# EAGLE design 2164_svf_single_plane_smd (EAGLE 9.6.2)
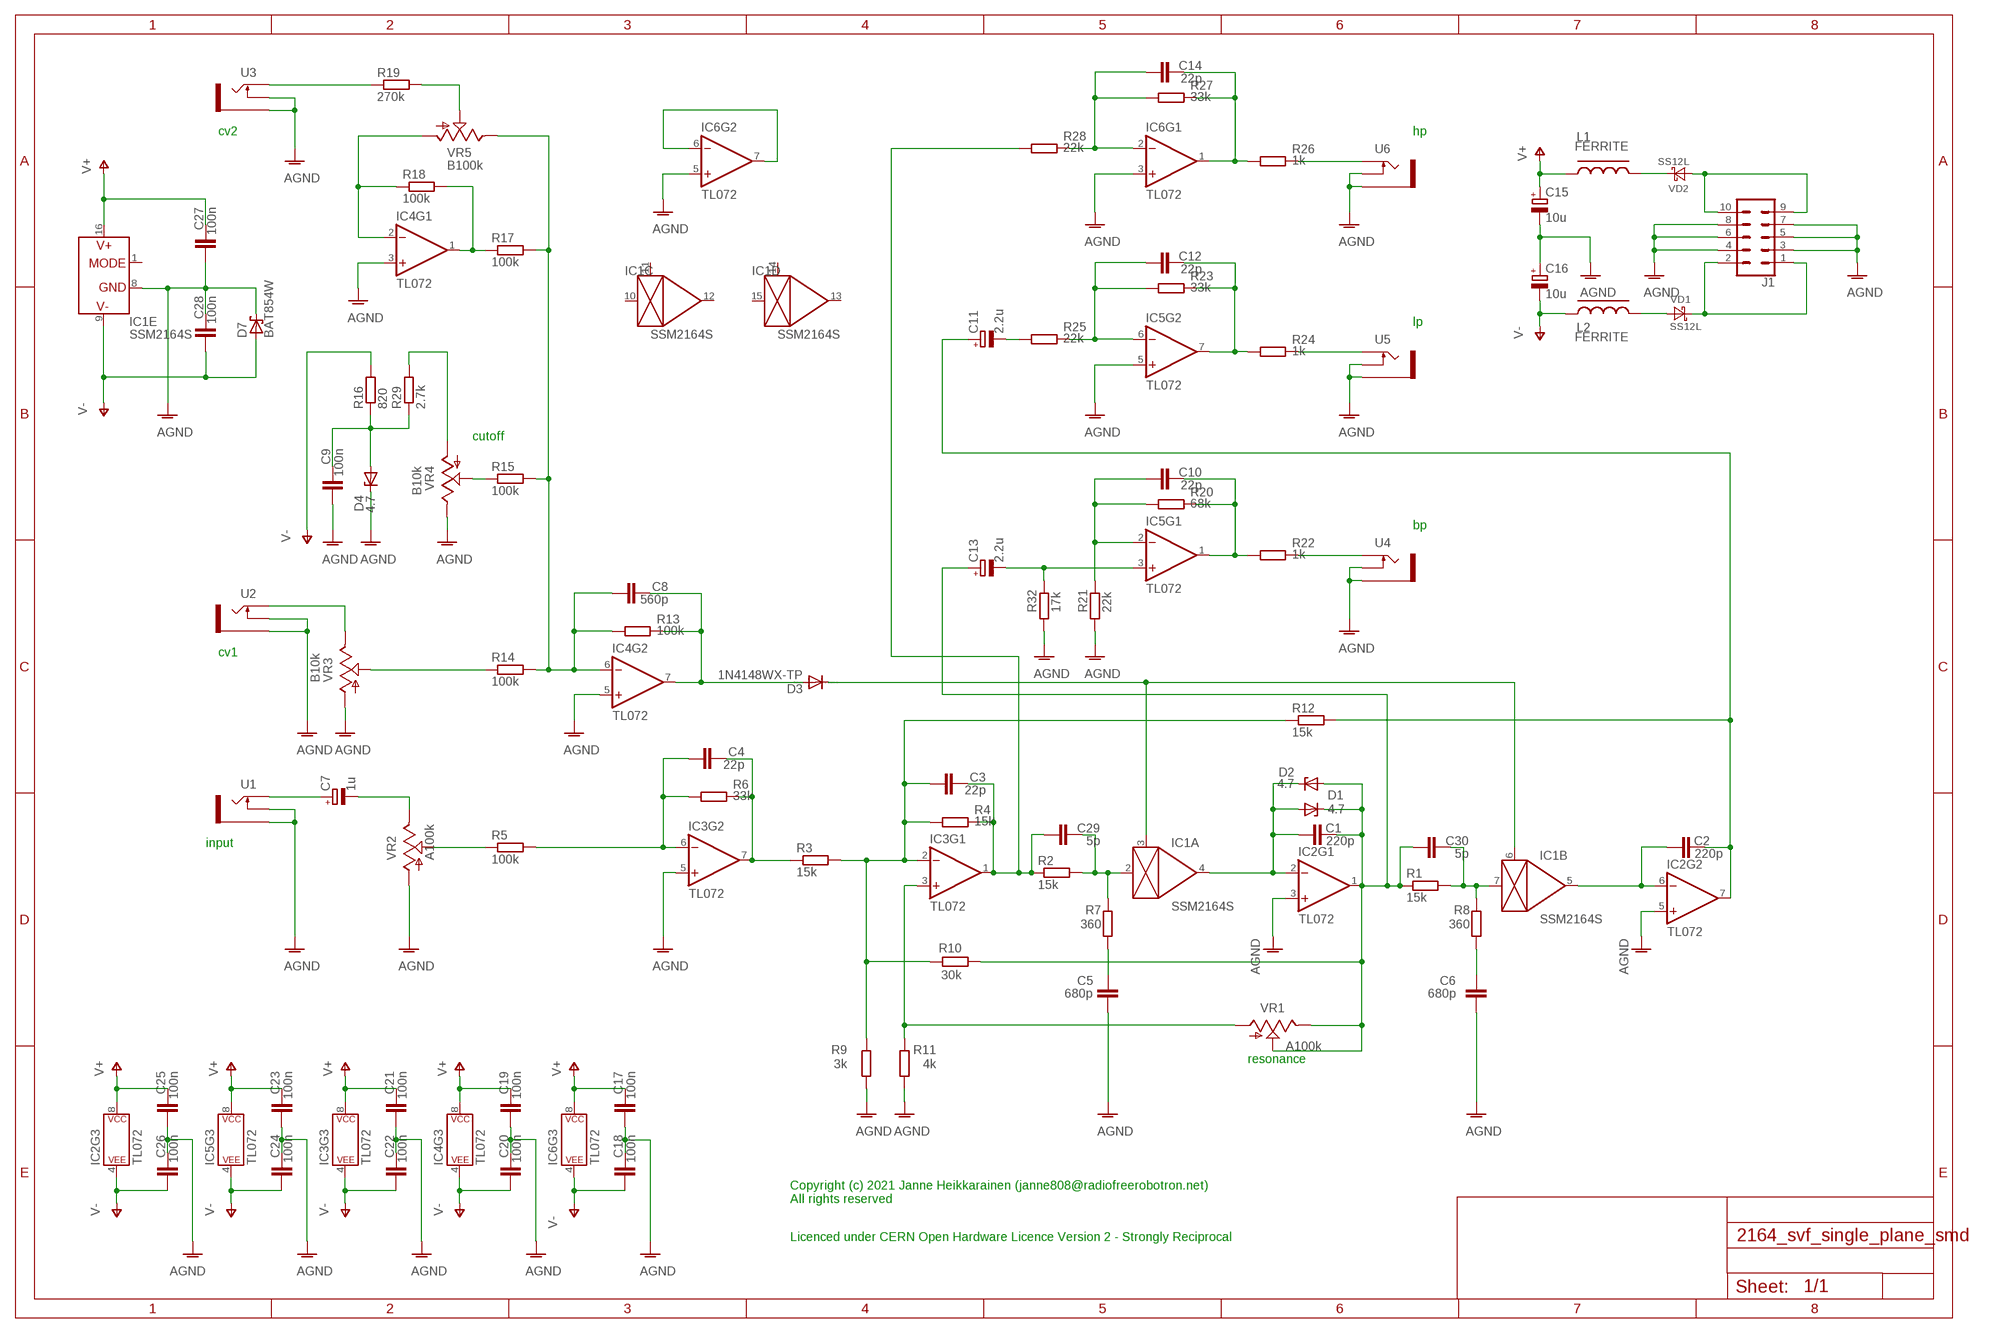
[diagram p0: schematic, sheet 1]

## Parts
C1  220p  C-EUC0603  [C0603]
C2  220p  C-EUC0603  [C0603]
C3  22p  C-EUC0603  [C0603]
C4  22p  C-EUC0603  [C0603]
C5  680p  C-EUC0603  [C0603]
C6  680p  C-EUC0603  [C0603]
C7  1u  CPOL-EUB  [PANASONIC_B]
C8  560p  C-EUC0603  [C0603]
C9  100n  C-EUC0603  [C0603]
C10  22p  C-EUC0603  [C0603]
C11  2.2u  CPOL-EUB  [PANASONIC_B]
C12  22p  C-EUC0603  [C0603]
C13  2.2u  CPOL-EUB  [PANASONIC_B]
C14  22p  C-EUC0603  [C0603]
C15  10u  CPOL-EUB  [PANASONIC_B]
C16  10u  CPOL-EUB  [PANASONIC_B]
C17  100n  C-EUC0603  [C0603]
C18  100n  C-EUC0603  [C0603]
C19  100n  C-EUC0603  [C0603]
C20  100n  C-EUC0603  [C0603]
C21  100n  C-EUC0603  [C0603]
C22  100n  C-EUC0603  [C0603]
C23  100n  C-EUC0603  [C0603]
C24  100n  C-EUC0603  [C0603]
C25  100n  C-EUC0603  [C0603]
C26  100n  C-EUC0603  [C0603]
C27  100n  C-EUC0603  [C0603]
C28  100n  C-EUC0603  [C0603]
C29  5p  C-EUC0603  [C0603]
C30  5p  C-EUC0603  [C0603]
D1  4.7  DIODE_ZENER-DIODESOD80C  [DIODE_SOD80C]
D2  4.7  DIODE_ZENER-DIODESOD80C  [DIODE_SOD80C]
D3  1N4148WX-TP  [SOD323R-INFINEON]
D4  4.7  DIODE_ZENER-DIODESOD80C  [DIODE_SOD80C]
D7  BAT854W  1PS70SB10  [SOT323]
IC1  SSM2164S  [SOIC16N]
IC2  TL072  OPAMP-DUALU  [SO08]
IC3  TL072  OPAMP-DUALU  [SO08]
IC4  TL072  OPAMP-DUALU  [SO08]
IC5  TL072  OPAMP-DUALU  [SO08]
IC6  TL072  OPAMP-DUALU  [SO08]
J1  CONN_05X2SHD  [2X5-SHROUDED]
L1  FERRITE  EXC3BP  [0603]
L2  FERRITE  EXC3BP  [0603]
R1  15k  R-EU_R0603  [R0603]
R2  15k  R-EU_R0603  [R0603]
R3  15k  R-EU_R0603  [R0603]
R4  15k  R-EU_R0603  [R0603]
R5  100k  R-EU_R0603  [R0603]
R6  33k  R-EU_R0603  [R0603]
R7  360  R-EU_R0603  [R0603]
R8  360  R-EU_R0603  [R0603]
R9  3k  R-EU_R0603  [R0603]
R10  30k  R-EU_R0603  [R0603]
R11  4k  R-EU_R0603  [R0603]
R12  15k  R-EU_R0603  [R0603]
R13  100k  R-EU_R0603  [R0603]
R14  100k  R-EU_R0603  [R0603]
R15  100k  R-EU_R0603  [R0603]
R16  820  R-EU_R0603  [R0603]
R17  100k  R-EU_R0603  [R0603]
R18  100k  R-EU_R0603  [R0603]
R19  270k  R-EU_R0603  [R0603]
R20  68k  R-EU_R0603  [R0603]
R21  22k  R-EU_R0603  [R0603]
R22  1k  R-EU_R0603  [R0603]
R23  33k  R-EU_R0603  [R0603]
R24  1k  R-EU_R0603  [R0603]
R25  22k  R-EU_R0603  [R0603]
R26  1k  R-EU_R0603  [R0603]
R27  33k  R-EU_R0603  [R0603]
R28  22k  R-EU_R0603  [R0603]
R29  2.7k  R-EU_R0603  [R0603]
R32  17k  R-EU_R0603  [R0603]
U1  THONKICONNNEW  [WQP-PJ301M-12_JACK]
U2  THONKICONNNEW  [WQP-PJ301M-12_JACK]
U3  THONKICONNNEW  [WQP-PJ301M-12_JACK]
U4  THONKICONNNEW  [WQP-PJ301M-12_JACK]
U5  THONKICONNNEW  [WQP-PJ301M-12_JACK]
U6  THONKICONNNEW  [WQP-PJ301M-12_JACK]
VD1  SS12L  DIODE-SCHOTTKY-SMA  [SMA]
VD2  SS12L  DIODE-SCHOTTKY-SMA  [SMA]
VR1  A100k  9MM_SNAP-IN_POT_  [9MM_SNAP-IN_POT]
VR2  A100k  9MM_SNAP-IN_POT_  [9MM_SNAP-IN_POT]
VR3  B10k  9MM_SNAP-IN_POT_  [9MM_SNAP-IN_POT]
VR4  B10k  9MM_SNAP-IN_POT_  [9MM_SNAP-IN_POT]
VR5  B100k  9MM_SNAP-IN_POT_  [9MM_SNAP-IN_POT]

## Nets
AGND: C5.1 C6.1 C9.1 C15.- C16.+ C17.1 C18.2 C19.1 C20.2 C21.1 C22.2 C23.1 C24.2 C25.1 C26.2 C27.1 C28.2 D4.C D7.3(K) IC1.8(E:GND) IC2.3(+IN) IC2.5(+IN) IC3.5(+IN) IC4.3(+IN) IC4.5(+IN) IC5.5(+IN) IC6.3(+IN) IC6.5(+IN) J1.3 J1.4 J1.5 J1.6 J1.7 J1.8 R9.1 R11.1 R21.1 R32.1 U1.P$2_SWITCH(SWITCH) U1.P$3_SLEEVE(SLEEVE) U2.P$2_SWITCH(SWITCH) U2.P$3_SLEEVE(SLEEVE) U3.P$2_SWITCH(SWITCH) U3.P$3_SLEEVE(SLEEVE) U4.P$2_SWITCH(SWITCH) U4.P$3_SLEEVE(SLEEVE) U5.P$2_SWITCH(SWITCH) U5.P$3_SLEEVE(SLEEVE) U6.P$2_SWITCH(SWITCH) U6.P$3_SLEEVE(SLEEVE) VR2.1(A) VR3.1(A) VR4.3(E)
N$1: C1.1 D1.A D2.C IC1.4(A:OUT) IC2.2(-IN)
N$2: C2.1 IC1.5(B:OUT) IC2.6(-IN)
N$3: R15.1 VR4.2(S)
N$4: C30.2 IC1.7(B:IN) R1.2 R8.2
N$5: C3.2 C29.1 IC3.1(OUT) R2.1 R4.2 R28.1
N$6: C29.2 IC1.2(A:IN) R2.2 R7.2
N$7: C9.2 D4.A R16.1 R29.1
N$8: C4.2 IC3.7(OUT) R3.1 R6.2
N$9: C3.1 IC3.2(-IN) R3.2 R4.1 R9.2 R10.2 R12.1
N$10: C4.1 IC3.6(-IN) R5.2 R6.1
N$11: R29.2 VR4.1(A)
N$12: C2.2 C11.+ IC2.7(OUT) R12.2
N$13: C7.- VR2.3(E)
N$14: C7.+ U1.P$1_TIP(TIP)
N$15: C5.2 R7.1
N$16: C6.2 R8.1
N$17: C8.2 D3.A IC4.7(OUT) R13.2
N$18: D3.C IC1.3(A:CTRL) IC1.6(B:CTRL)
N$19: R14.1 VR3.2(S)
N$20: R5.1 VR2.2(S)
N$21: U2.P$1_TIP(TIP) VR3.3(E)
N$22: R26.2 U6.P$1_TIP(TIP)
N$23: IC4.1(OUT) R17.1 R18.2
N$24: R24.2 U5.P$1_TIP(TIP)
N$25: R22.2 U4.P$1_TIP(TIP)
N$26: C10.1 IC5.2(-IN) R20.1 R21.2
N$27: R19.1 U3.P$1_TIP(TIP)
N$28: R19.2 VR5.2(S)
N$29: C10.2 IC5.1(OUT) R20.2 R22.1
N$30: C13.- IC5.3(+IN) R32.2
N$31: C12.1 IC5.6(-IN) R23.1 R25.2
N$32: L1.2 VD2.C
N$33: C12.2 IC5.7(OUT) R23.2 R24.1
N$34: C11.- R25.1
N$35: L2.2 VD1.A
N$37: IC6.6(-IN) IC6.7(OUT)
N$39: C14.2 IC6.1(OUT) R26.1 R27.2
N$40: C14.1 IC6.2(-IN) R27.1 R28.2
N$42: J1.1 J1.2 VD1.C
N$43: J1.9 J1.10 VD2.A
TO_CV2_POT1: C8.1 IC4.6(-IN) R13.1 R14.2 R15.2 R17.2 VR5.3(E)
TO_CV2_POT2: IC4.2(-IN) R18.1 VR5.1(A)
TO_RESO_POT1: C1.2 C13.+ C30.1 D1.C D2.A IC2.1(OUT) R1.1 R10.1 VR1.2(S) VR1.3(E)
TO_RESO_POT2: IC3.3(+IN) R11.2 VR1.1(A)
V+: C15.+ C17.2 C19.2 C21.2 C23.2 C25.2 C27.2 IC1.16(E:V+) IC2.8(P$V+) IC3.8(P$V+) IC4.8(P$V+) IC5.8(P$V+) IC6.8(P$V+) L1.1
V-: C16.- C18.1 C20.1 C22.1 C24.1 C26.1 C28.1 D7.1(A) IC1.9(E:V-) IC2.4(P$V-) IC3.4(P$V-) IC4.4(P$V-) IC5.4(P$V-) IC6.4(P$V-) L2.1 R16.2
Unconnected: IC1.1(E:MODE) IC1.10(C:IN) IC1.11(C:CTRL) IC1.12(C:OUT) IC1.13(D:OUT) IC1.14(D:CTRL) IC1.15(D:IN)

## Notes on the sheet
- cv2 | hp
- lp
- cutoff
- bp
- cv1
- input
- resonance
- Copyright (c) 2021 Janne Heikkarainen (janne808@radiofreerobotron.net)
  All rights reserved
- Licenced under CERN Open Hardware Licence Version 2 - Strongly Reciprocal

## Library data of the parts
C1-C6 C8-C10 C12 C14 C17-C30 = rcl:C-EU: CAPACITOR, European symbol; SPICEPREFIX: C
C7 C11 C13 C15 C16 = rcl:CPOL-EU: POLARIZED CAPACITOR, European symbol; SPICEPREFIX: C
D1 D2 D4 = Diode-SMD:DIODE_ZENER-DIODE: Z-Diode
D3 = Diode-SMD:1N4148WX-TP
D7 = nxp_60:1PS70SB10: Schottky barrier diode Planar Schottky barrier diode encapsulated in a SOT323 very small plastic SMD package. Single diodes and double diodes with different pinning are available. AAL Eindhoven MK
IC1 = ssm2164:SSM2164
IC2-IC6 = SparkFun-IC-Amplifiers:OPAMP-DUAL: Generic op-amp footprint This component is for the standard 358 pinning of a dual op-amp From the LM358 datasheet: Pin 1: Output A Pin 2: Inverting Input A Pin 3: Non-Inverting Input A Pin 4: Gnd Pin 5: Non-Inverting Input B Pin 6: Inverting Input B Pin 7: Output B Pin 8: V+; PROD_ID: NA-XXXXX; VALUE: OP-AMP
J1 = SparkFun-Connectors:CONN_05X2: Multi connection point. Often used as Generic Header-pin footprint for 0.1 inch spaced/style header connections For AVR SPI programming port, see special device with nice symbol: "AVR_SPI_PROG_5x2.dev" You can populate with any combo of single row headers, but if you'd like an exact match, check these: 2x5 AVR ICSP Male Header <https://www.sparkfun.com/products/778> (PRT-00778) 2x5 Pin Shrouded Header <https://www.sparkfun.com/products/8506> (PRT-08506) On any of the 0.1 inch spaced packages, you can populate with these: Break Away Headers - Straight <https://www.sparkfun.com/products/116> (PRT-00116) Break Away Male Headers - Right Angle <https://www.sparkfun.com/products/553> (PRT-00553) Female Headers <https://www.sparkfun.com/products/115> (PRT-00115) Break Away Headers - Machine Pin <https://www.sparkfun.com/products/117> (PRT-00117) Break Away Female Headers - Swiss Machine Pin <https://www.sparkfun.com/products/743> (PRT-00743) Special note: the shrouded connector mates well with our 5x2 ribbon cables: 2x5 Pin IDC Ribbon Cable <https://www.sparkfun.com/products/8535> (PRT-08535); PROD_ID: CONN-08671; SF_ID: PRT-08506
L1 L2 = barthess:EXC3BP: Chip Bead Core; PARTNO: ?
R1-R29 R32 = rcl:R-EU_: RESISTOR, European symbol; SPICEPREFIX: R
U1-U6 = MusicThingModular:THONKICONN: 3.5mm socket for Eurorack modular synths
VD1 VD2 = diode:DIODE-SCHOTTKY-: SCHOTTKY DIODE
VR1-VR5 = MusicThingModular:9MM_SNAP-IN_POT: 9mm vertical snap-in pot, Alpha / Panasonic style

## Board
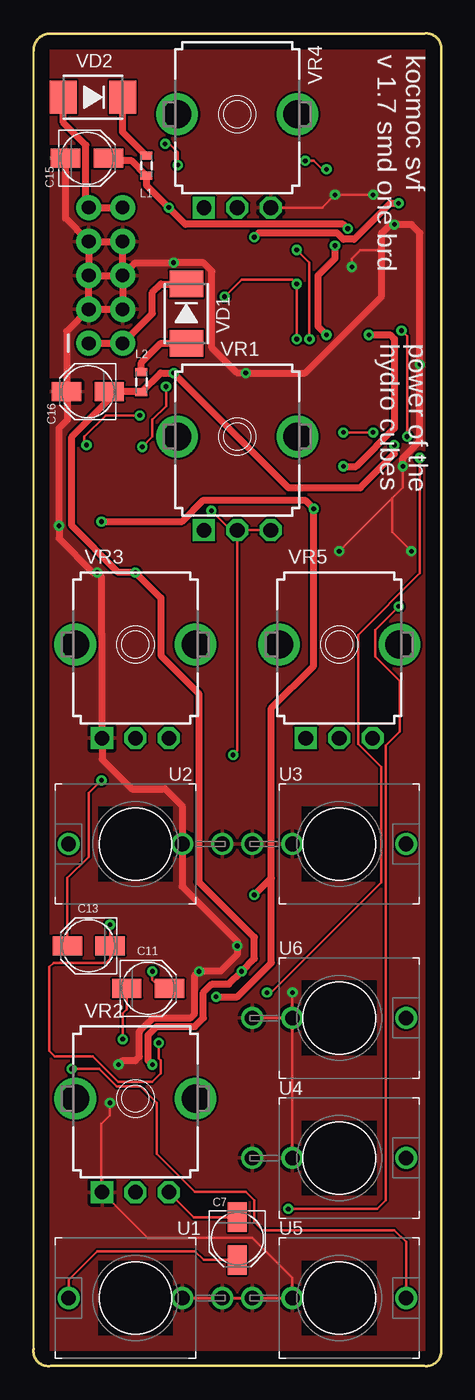
[diagram p1: board, top side]
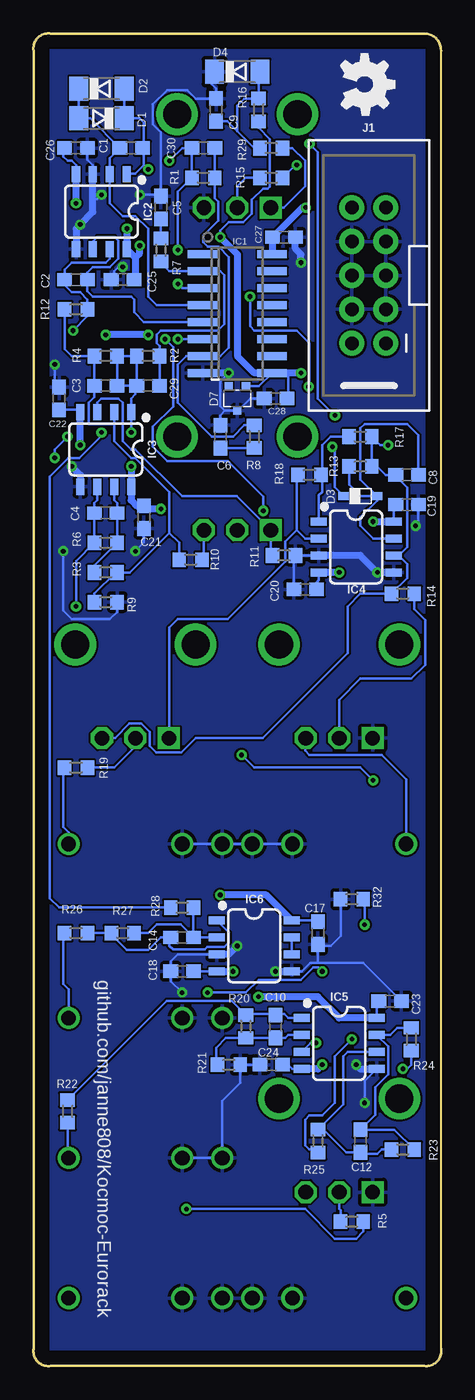
[diagram p2: board, bottom side, seen from below]

Size 30.5 x 99.72 mm. Coordinates in mm from the lower left corner, seen from the top.
Outline: 0.01,1.28 0.01,98.44 arc-90 1.28,99.71 29.22,99.71 arc-106 30.49,98.44 30.49,1.28 arc-106 29.22,0.01 1.28,0.01 arc-106 0.01,1.28
Copper layers (1*16): Top 0.035mm / dielectric 1.5mm / Bottom 0.035mm
Design rules "default": minimum track width 6mil, minimum drill 0.35mm, track to track 6mil, track to pad 6mil, pad to pad 6mil, via to via 6mil, smd to smd 6mil, copper to edge 40mil, drill to drill 6mil, minimum pad ring 10mil, minimum via ring 8mil, stop-mask expansion 4mil, vias tented up to drill 0mil, thermal gap 10mil

### Footprints (pad centres in the part's own frame; a part is rotated, then mirrored left to right if it is on the bottom)
C0603 = smd 1.1 x 1: 1 -0.85,0; 2 0.85,0
PANASONIC_B = smd 2.2 x 1.4: + 1.6,0; - -1.6,0
DIODE_SOD80C = smd 1.4 x 1.8: A 1.7,0; C -1.7,0
SOD323R-INFINEON = smd 0.8 x 0.6: A 1.25,0; C -1.25,0
SOT323 = smd 0.6 x 0.6: 1 -0.65,-0.925; 2 0.65,-0.925; 3 0,0.925
SOIC16N = smd 0.6 x 2.2: 1 -4.445,-2.6; 2 -3.175,-2.6; 3 -1.905,-2.6; 4 -0.635,-2.6; 5 0.635,-2.6; 6 1.905,-2.6; 7 3.175,-2.6; 8 4.445,-2.6; 9 4.445,2.6; 10 3.175,2.6; 11 1.905,2.6; 12 0.635,2.6; 13 -0.635,2.6; 14 -1.905,2.6; 15 -3.175,2.6; 16 -4.445,2.6
SO08 = smd 0.6 x 1.2: 1 -1.905,-2.8; 2 -0.635,-2.8; 3 0.635,-2.8; 4 1.905,-2.8; 5 1.905,2.8; 6 0.635,2.8; 7 -0.635,2.8; 8 -1.905,2.8
2X5-SHROUDED = drill 1.016 pad 1.88: 1 -1.27,5.08; 2 1.27,5.08; 3 -1.27,2.54; 4 1.27,2.54; 5 -1.27,0; 6 1.27,0; 7 -1.27,-2.54; 8 1.27,-2.54; 9 -1.27,-5.08; 10 1.27,-5.08
0603 = smd 0.6 x 0.9: 1 -0.8,0; 2 0.7,0
R0603 = smd 1 x 1.1: 1 -0.85,0; 2 0.85,0
WQP-PJ301M-12_JACK = drill 1.1: P$1_TIP 0,5; P$2_SWITCH 0,-3.5; P$3_SLEEVE 0,-6.5
SMA = smd 2 x 2.5: A 2.223,0; C -2.223,0
9MM_SNAP-IN_POT = drill 1.1 square: 1 -2.5,-7 | drill 1.1 octagon: 2 0,-7; 3 2.5,-7 | drill 2.1 pad 2.794: CHASSIS1 -4.5,0; CHASSIS2 4.5,0

### Placement (x,y rotation side)
C1  23.19,91.13 0 bottom
C2  27.32,81.29 180 bottom
C3  25.09,73.35 0 bottom
C4  25.09,63.83 0 bottom
C5  20.97,86.69 270 bottom
C6  16.52,69.54 270 bottom
C7  15.25,9.54 270 top
C8  2.55,66.69 0 bottom
C9  16.84,93.99 270 bottom
C10  12.39,25.41 90 bottom
C11  8.58,28.27 0 top
C12  6.04,16.84 90 bottom
C13  4.14,31.44 180 top
C14  19.38,32.08 180 bottom
C15  4.01,90.37 0 top
C16  4.07,72.91 180 top
C17  9.22,32.4 90 bottom
C18  19.38,29.54 180 bottom
C19  2.55,64.46 180 bottom
C20  10.17,58.11 180 bottom
C21  22.24,63.51 90 bottom
C22  28.59,72.4 90 bottom
C23  3.82,27.32 180 bottom
C24  12.71,22.55 180 bottom
C25  23.82,81.29 0 bottom
C26  27.32,91.13 0 bottom
C27  11.76,84.47 180 bottom
C28  12.39,72.4 180 bottom
C29  21.92,73.35 0 bottom
C30  17.79,91.13 0 bottom
D1  25.41,93.36 180 bottom
D2  25.41,95.58 0 bottom
D3  6.04,65.1 0 bottom
D4  15.25,96.85 0 bottom
D7  15.25,72.4 180 bottom
IC1  15.25,78.75 270 bottom
IC2  25.41,86.37 180 bottom
IC3  25.09,68.59 180 bottom
IC4  6.36,61.29 270 bottom
IC5  7.63,24.14 270 bottom
IC6  13.98,31.44 270 bottom
J1  5.41,81.61 180 bottom
L1  8.46,89.86 90 top
L2  8.07,73.67 90 top
R1  17.79,88.91 0 bottom
R2  21.92,75.58 0 bottom
R3  25.09,59.38 0 bottom
R4  25.09,75.58 0 bottom
R5  6.68,10.81 0 bottom
R6  25.09,61.61 0 bottom
R7  20.97,83.51 270 bottom
R8  13.98,69.54 90 bottom
R9  25.09,57.16 180 bottom
R10  18.74,60.34 180 bottom
R11  11.76,60.65 180 bottom
R12  27.32,79.07 0 bottom
R13  6.04,67.32 180 bottom
R14  2.87,57.8 180 bottom
R15  12.71,88.91 0 bottom
R16  13.66,93.99 270 bottom
R17  6.04,69.54 0 bottom
R18  9.85,66.69 0 bottom
R19  27.32,44.78 0 bottom
R20  14.62,25.41 90 bottom
R21  15.89,22.55 180 bottom
R22  27.95,19.06 270 bottom
R23  2.87,16.2 0 bottom
R24  2.23,24.46 270 bottom
R25  9.22,16.84 90 bottom
R26  27.32,32.4 180 bottom
R27  23.82,32.4 180 bottom
R28  19.38,34.3 0 bottom
R29  12.71,91.13 0 bottom
R32  6.68,34.94 0 bottom
U1  7.63,5.09 90 top
U2  7.63,39.06 90 top
U3  22.87,39.06 270 top
U4  22.87,15.57 270 top
U5  22.87,5.09 270 top
U6  22.87,26.05 270 top
U$1  [OSHW_5MM]  5.73,95.9 270 bottom
VD1  11.44,78.75 270 top
VD2  4.46,94.94 180 top
VR1  15.25,69.54 0 top
VR2  7.63,20.01 0 top
VR3  7.63,53.99 0 top
VR4  15.25,93.67 0 top
VR5  22.87,53.99 0 top

### Tracks (layer width: path | path; a pad name or v marks a point on that pad's centre or on a via)
AGND  (via drill 0.35)
  Top 0.2: v5.73,19.7 5.73,18.74 5.09,18.11 5.09,13.05 VR2.1 8.54,9.61 16.37,9.61 19.38,6.6 U5.P$2_SWITCH U5.P$3_SLEEVE U1.P$3_SLEEVE U1.P$2_SWITCH | U6.P$3_SLEEVE U6.P$2_SWITCH | U4.P$2_SWITCH U6.P$2_SWITCH | U6.P$2_SWITCH v19.37,27.94 v19.38,27.95 | v22.87,60.97 26.84,64.94 | 26.84,64.94 27.63,65.73 v27.63,67.32 | 26.84,64.94 26.84,62.4 v28.27,60.97 | v25.41,87.64 v22.55,87.64 21.6,86.69 17.77,86.69 VR4.3 | v23.82,82.24 23.82,82.88 24.46,83.51 26.05,83.51
  Top 0.508: J1.7 J1.8 J1.6 | J1.5 J1.6 | J1.3 J1.4 J1.6 | J1.3 J1.5 | J1.7 J1.5 | J1.3 2.47,77.4 C16.+ 2.42,72.85 2.55,72.72 2.55,70.81 1.92,70.18 v1.92,62.88 1.92,61.92 4.46,59.38 v4.77,59.38 5.09,59.07 5.09,54.8 5.09,47.02 VR3.1 5.13,45.4 7.34,43.19 9.85,43.19 11.13,41.91 U2.P$2_SWITCH 11.13,35.88 15.25,31.76 v15.25,31.44 15.25,30.81 13.98,29.54 v12.39,29.54 12.08,29.22 12.08,29.2 12.05,29.18 12.05,26.36 11.76,26.07 8.94,26.07 7.92,25.05 7.92,23.16 7.63,22.87 6.68,22.87 v6.36,22.55 | v27.63,67.32 27.63,67.96 28.9,69.23 v28.9,74.94 28.9,84.78 28.27,85.42 v27,85.42 26.68,85.42 26.05,84.78 26.05,83.51 26.05,80.02 20.33,74.31 v15.89,74.31 15.25,74.31 13.35,76.21 13.35,81.93 12.71,82.56 v10.49,82.56 7.63,82.56 J1.6 | J1.7 2.41,85.88 C15.-
  Bottom 0.2: C24.2 R21.1 15.04,21.18 16.37,19.85 U4.P$3_SLEEVE U4.P$2_SWITCH | IC6.5 10.43,29.54 9.8,30.17 9.22,30.17 | C23.1 5.82,30.17 9.22,30.17 | IC5.5 5.73,21.34 v5.73,19.7 | v19.38,27.95 20.23,28.8 C18.2 20.23,30.28 19.7,30.81 IC6.3 | C17.1 9.22,31.44 | 9.22,31.44 9.22,30.17 | v22.87,60.97 22.24,61.61 C21.1 | v28.27,60.97 28.27,56.53 27.63,55.89 24.78,55.89 24.24,56.42 R9.1 | C22.2 28.9,73.57 v28.9,74.94 | IC4.3 R11.1 11.02,60.54 C20.2 | IC2.3 26.05,89.86 26.47,90.28 C26.2 | D4.C 17.16,96.64 17.16,95.9 16.84,95.58 C9.1 18.36,94.84 19,95.48 20.5,95.48 21.56,94.42 21.56,92.92 20.97,92.33 20.97,87.64 | 16.18,71.48 D7.3 15.22,71.48 14.3,72.4 C28.2 | 16.18,71.48 16.52,71.13 C6.1 | v15.89,74.31 16.52,73.67 16.52,71.82 16.18,71.48 | U2.P$2_SWITCH U2.P$3_SLEEVE U3.P$3_SLEEVE U3.P$2_SWITCH | 20.97,87.64 C5.1 | 26.05,87.32 25.73,87.32 v25.41,87.64 | v22.55,87.64 20.97,87.64 | R32.1 7.53,32.18 8.27,31.44 9.22,31.44 | C19.1 1.7,63.09 v1.92,62.88 | C25.1 24.46,81.51 24.46,81.93 24.14,82.24 v23.82,82.24
  Bottom 0.508: v15.89,74.31 IC1.8 | v10.49,82.56 10.49,83.2 10.91,83.62 C27.1 | IC2.5 27.32,85.1 v27,85.42 26.05,86.37 26.05,87.32 IC2.3 | v27.63,67.32 27,66.69 IC3.5 | IC4.5 v4.77,59.38 6.04,60.65 IC4.3 | v15.25,31.44 15.89,30.81 IC6.3 | v12.39,29.54 IC6.5 | v6.36,22.55 6.04,22.24 IC5.5
  pour Top: 1.28,0.65 29.22,0.65 29.22,99.07 1.28,99.07
  pour Bottom: 1.28,0.65 29.22,0.65 29.22,99.07 1.28,99.07
N$1
  Bottom 0.2: D2.C D1.A 26.26,93.36 C1.1 24.78,90.4 IC2.2 24.78,87.01 23.82,86.05 22.87,86.05 21.92,85.1 21.92,80.02 21.28,79.39 IC1.4
N$2
  Bottom 0.2: IC1.5 22.24,78.12 22.97,78.85 22.97,79.81 23.19,80.02 26.05,80.02 26.47,80.44 C2.1 26.47,81.82 26.08,82.21 24.81,82.21 24.14,82.88 24.14,84.19 24.41,84.47 25.73,84.47 26.05,84.15 IC2.6
N$3
  Bottom 0.2: R15.1 14.62,88.91 15.25,88.28 VR4.2
N$4
  Bottom 0.2: C30.2 R1.2 16.94,87.39 16.67,87.12 16.67,85.71 17.79,84.6 17.79,84.08 17.46,83.75 16.65,83.75 15.89,82.99 15.89,76.21 16.52,75.58 IC1.7 19.06,75.58 19.7,74.94 19.7,72.08 17.16,69.54 15.57,69.54 14.72,70.39 R8.2
N$5  (via drill 0.35)
  Top 0.2: v23.19,69.86 v25.41,69.86
  Bottom 0.2: C29.1 22.87,73.25 22.87,72.72 23.19,72.4 IC3.1 v23.19,69.86 | C29.1 C3.2 R4.2 R2.1 C29.1 | v25.41,69.86 25.41,69.6 27.06,67.95 27.89,67.95 29.27,66.57 29.27,34.99 28.59,34.3 R28.1
N$6
  Bottom 0.2: C29.2 R2.2 21.07,76.31 21.28,76.53 21.28,77.16 20.97,77.48 16.73,77.48 16.24,77.97 16.24,81.64 16.52,81.93 IC1.2 20.33,81.93 20.97,82.56 R7.2
N$7
  Bottom 0.2: R29.1 13.98,91.13 15.25,92.4 | C9.2 15.99,93.14 15.25,92.4 | D4.A 13.66,96.74 R16.1 14.72,94.84 15.25,94.31 15.25,92.4
N$8
  Bottom 0.2: R3.1 25.94,59.91 R6.2 C4.2 24.24,64.57 24.46,64.78 IC3.7
N$9
  Bottom 0.2: R9.2 25.94,57.8 24.36,59.38 R3.2 23.29,59.38 20.33,62.34 | 20.33,62.34 20.33,65.42 22.87,67.96 23.19,67.96 24.46,69.23 24.46,70.5 | IC3.2 24.46,70.5 | 24.46,70.5 26.36,70.5 26.36,72.08 25.94,72.5 C3.1 R4.1 27.63,75.58 28.17,76.11 R12.1 | R10.2 19.59,61.61 20.33,62.34
N$10  (via drill 0.35)
  Top 0.2: v27.32,56.84 25.56,55.09 25.56,53.08 27.4,51.24 27.4,47.49 26.36,46.45 26.36,12.39 25.73,11.76 v19.06,11.76
  Bottom 0.2: IC3.6 25.73,64.78 25.94,64.57 C4.1 R6.1 27.32,60.23 v27.32,56.84 | v19.06,11.76 10.17,11.76 7.95,9.54 6.36,9.54 5.83,10.07 R5.2
N$11
  Bottom 0.2: VR4.1 11.77,86.67 10.17,88.28 10.17,90.18 11.12,91.13 R29.2
N$12  (via drill 0.35)
  Top 0.2: v27.53,77.48 27.95,77.06 v27.95,69.54 | v28.9,67.96 28.9,59.32 24.29,54.71 24.29,46.54 26.01,44.82 26.01,36.17 17.79,27.95 v17.47,27.95 | v8.9,29.54 8.9,28.9 9.54,28.27 C11.+
  Bottom 0.2: IC2.7 24.78,82.88 25.09,82.56 27.63,82.56 28.17,82.03 C2.2 28.17,80.87 27.63,80.34 27,80.34 26.47,79.81 R12.2 26.47,78.55 v27.53,77.48 | v27.95,69.54 28.9,68.59 v28.9,67.96 | v17.47,27.95 14.62,27.95 13.66,28.9 10.49,28.9 9.57,29.82 9.18,29.82 v8.9,29.54
N$13
  Top 0.2: VR2.3 12.01,11.14 C7.-
N$14
  Top 0.2: U1.P$1_TIP 2.63,6.44 4.77,8.58 12.08,8.58 12.72,7.94 C7.+
N$15
  Bottom 0.2: C5.2 R7.1
N$16
  Bottom 0.2: R8.1 C6.2
N$17
  Bottom 0.2: D3.A 6.04,65.1 6.89,65.95 R13.2 | IC4.7 5.09,61.92 6.04,62.88 6.04,63.51 4.79,64.76 D3.A | D3.A 6.04,66.35 6.04,70.18 5.73,70.5 2.55,70.5 1.7,69.65 C8.2
N$18  (via drill 0.35)
  Top 0.2: v8.14,68.78 8.9,69.54 8.9,70.81 9.92,71.83 v9.92,73.29 | v14.3,80.02 15.57,81.29 19.38,81.29 v19.7,80.97 v19.7,76.85
  Bottom 0.2: D3.C 7.95,65.75 7.95,68.59 v8.14,68.78 | v9.92,73.29 9.86,73.35 9.86,76.53 10.81,77.48 13.98,77.48 14.3,77.8 v14.3,80.02 | v19.7,80.97 19.38,80.66 IC1.3 | IC1.6 v19.7,76.85
N$19
  Bottom 0.2: VR3.2 7.63,49.86 6.04,51.45 2.23,51.45 1.2,52.48 1.2,55.81 2.02,56.63 R14.1
N$20
  Bottom 0.2: R5.1 7.53,11.66 7.63,11.76 VR2.2
N$21
  Bottom 0.2: U2.P$1_TIP 2.63,43.91 4.46,45.73 9.85,45.73 10.17,46.05 10.17,46.95 VR3.3
N$22
  Bottom 0.2: U6.P$1_TIP 27.87,28.19 28.27,28.59 28.27,32.29 R26.2
N$23
  Bottom 0.2: IC4.1 9.16,65.16 8.9,65.42 8.9,66.58 R18.2 8.9,66.79 8.9,68.91 8.27,69.54 R17.1
N$24  (via drill 0.35)
  Top 0.2: v2.87,22.24 4.91,22.24 6.21,20.93 7.98,20.93 9.22,19.7 9.22,15.89 12.08,13.03 15.89,13.03 16.52,12.39 16.52,10.81 17.16,10.17 27,10.17 27.87,9.3 U5.P$1_TIP
  Bottom 0.2: v2.87,22.24 2.55,22.24 2.23,22.55 R24.2
N$25
  Bottom 0.2: U4.P$1_TIP 27.95,15.65 R22.2
N$26
  Bottom 0.2: R21.2 16.84,22.66 16.84,23.82 16.1,24.56 R20.1 C10.1 11.66,24.56 11.44,24.78 IC5.2
N$27
  Bottom 0.2: U3.P$1_TIP 27.87,39.94 28.27,40.33 28.27,44.68 R19.1
N$28
  Bottom 0.2: R19.2 24.46,44.78 22.87,46.37 VR5.2
N$29
  Bottom 0.2: IC5.1 11.44,26.05 11.76,26.36 12.29,26.36 C10.2 12.5,26.36 14.51,26.36 R20.2 15.67,27.32 20.55,27.32 R22.1
N$30  (via drill 0.35)
  Top 0.2: v5.73,33.03 5.74,33.02 C13.- 5.74,30.5 5.41,30.17 1.52,30.17 1.2,29.86 1.2,23.58 1.6,23.19 4.46,23.19 6.36,21.28 8.9,21.28 9.54,21.92 9.54,22.87 9.37,23.04 v9.37,24.19
  Bottom 0.2: v5.73,33.03 5.73,34.83 R32.2 | IC5.3 9.8,24.14 9.42,24.14 v9.37,24.19
N$31
  Bottom 0.2: R23.1 4.46,16.2 4.77,15.89 5.94,15.89 C12.1 7.1,15.99 8.8,17.69 R25.2 7.31,19.59 7.31,23.19 7,23.51 IC5.6
N$32
  Top 0.508: L1.2 6.68,92.34 VD2.C
N$33
  Bottom 0.2: R24.1 3.29,25.31 3.82,24.78 IC5.7 4.83,24.76 3.98,23.91 3.98,21.83 4.94,20.87 4.94,18.79 C12.2 3.5,17.69 R23.2
N$34  (via drill 0.35)
  Top 0.2: C11.- 6.98,26.69 6.68,26.39 v6.68,24.46
  Bottom 0.2: R25.1 9.22,16.2 9.85,16.2 10.17,16.52 10.17,18.43 9.85,18.74 8.9,18.74 7.95,19.7 7.95,23.19 v6.68,24.46
N$35
  Top 0.508: L2.2 8.08,75.07 9.54,76.53 VD1.A
N$37
  Bottom 0.2: IC6.7 IC6.6
N$39
  Bottom 0.2: R26.1 R27.2 24.67,32.29 23.51,31.13 21.92,31.13 20.97,32.08 C14.2 20.33,31.98 20.33,31.44 20.05,31.16 17.69,31.16 17.49,31.36 16.24,31.36 15.89,31.72 15.89,32.45 IC6.1
N$40
  Bottom 0.2: IC6.2 C14.1 | C14.1 R28.2 | C14.1 19.48,33.03 21.28,33.03 21.92,32.4 R27.1
N$42
  Top 0.508: J1.1 J1.2 8.9,78.75 8.9,80.34 9.54,80.97 VD1.C
N$43
  Top 0.508: J1.10 J1.9 3.92,86.91 3.92,91.35 2.23,93.04 VD2.A
TO_CV2_POT1  (via drill 0.35)
  Top 0.2: v10.81,89.86 10.81,90.82 10.17,91.45 v9.85,91.45 | v7.95,71.13 5.41,71.13 3.82,69.54 3.82,69.06 v3.97,68.91
  Bottom 0.2: C8.1 3.5,66.69 | 3.5,66.69 4.14,66.69 4.77,67.32 R13.1 R17.2 4.56,68.91 v3.97,68.91 | IC4.6 3.19,60.65 | 3.19,60.65 2.55,61.29 2.55,65.73 3.5,66.69 | R15.2 10.91,89.86 v10.81,89.86 | v9.85,91.45 9.22,90.82 9.22,72.4 v7.95,71.13 | 3.19,60.65 2.55,60.02 2.55,58.96 R14.2 6.04,57.8 7,56.84 7,53.35 13.36,46.99 18.36,46.99 19.44,45.91 21.3,45.91 21.79,46.4 21.79,47.43 22.42,48.06 23.32,48.06 24.39,46.99 VR5.3
TO_CV2_POT2
  Bottom 0.2: IC4.2 10.17,61.92 10.81,62.56 | 10.81,62.56 10.81,66.58 R18.1 | 10.81,62.56 11.67,61.69 11.67,60.18 15.96,55.89 19.7,55.89 20.33,55.26 20.33,47.03 VR5.1
TO_RESO_POT1  (via drill 0.35)
  Top 0.2: VR1.2 VR1.3 | C13.+ 2.54,36.51 4.14,38.11 4.14,42.87 v5.09,43.83 | v14.93,45.73 15.25,46.05 VR1.2 | v20.33,90.18 20.97,90.18 21.6,89.55 v21.92,89.55 | v19.7,83.51 20.65,82.56 v20.65,76.85 | v13.31,64 14.76,62.54 VR1.2
  Bottom 0.2: v5.09,43.83 6.04,44.78 13.98,44.78 v14.93,45.73 | IC2.1 23.45,89.23 22.87,89.23 22.24,89.86 | 22.24,89.86 22.24,91.03 C1.2 22.24,91.24 22.24,93.04 22.55,93.36 D1.C D2.A | v20.33,90.18 19.38,91.13 C30.1 R1.1 19.7,87.86 v19.7,83.51 | v21.92,89.55 22.24,89.86 | R10.1 17.75,60.48 VR1.3 | v13.31,64 13.31,65.06 15.98,67.73 20.5,67.73 21.56,68.79 21.56,70.29 20.05,71.81 20.05,76.25 v20.65,76.85
TO_RESO_POT2
  Bottom 0.2: R11.2 12.75,60.8 VR1.1 15.31,65.1 19.38,65.1 22.87,68.59 23.19,68.59 23.82,69.23 23.82,72.08 24.14,72.4 25.41,72.4 25.73,72.08 IC3.3
V+  (via drill 0.35)
  Top 0.508: v23.51,85.1 23.16,85.44 11.37,85.44 v10.12,86.69 8.46,88.36 L1.1 7.34,90.18 5.8,90.18 C15.+ | v21.92,77.16 21.28,77.8 21.28,81.61 22.55,82.88 v22.55,83.83 | v25.09,77.16 26.68,77.16 27,76.85 27,70.18 24.14,67.32 v23.19,67.32 | v13.66,27.63 15.25,27.63 17.79,30.17 17.79,36.52 | 17.79,36.52 17.79,49.22 20.97,52.4 v20.97,64.15 20.33,64.78 12.71,64.78 11.12,63.19 v5.09,63.19 | v16.52,35.25 17.79,36.52
  Bottom 0.2: C23.2 4.83,27.16 IC5.8 | C17.2 9.32,33.35 IC6.8 | C19.2 3.56,64.3 IC4.8
  Bottom 0.508: IC1.16 12.61,83.24 C27.2 10.39,86.69 v10.12,86.69 | v23.51,85.1 IC2.8 22.87,82.94 | v21.92,77.16 v25.09,77.16 | v23.19,67.32 IC3.8 23.19,64.78 22.77,64.36 C21.2 22.02,64.15 v20.97,64.15 | v5.09,63.19 IC4.8 | IC5.8 7.63,26.05 9.22,27.63 v13.66,27.63 | IC6.8 13.09,35.25 v16.52,35.25 | 22.87,82.94 22.87,81.39 C25.2 | 22.87,82.94 22.55,83.25 v22.55,83.83
V-  (via drill 0.35)
  Top 0.508: v27.32,87.01 26.68,87.01 23.99,84.32 23.18,84.32 22.72,84.78 16.84,84.78 v16.52,84.47 | v27,68.91 27,68.27 24.46,65.73 19.06,65.73 v10.49,74.31 9.51,74.31 L2.1 8.04,72.91 C16.- 5.67,72.35 2.87,69.54 2.87,62.88 6.36,59.38 v7.63,59.38 9.53,57.48 9.53,53.17 12.36,50.34 12.36,36.24 16.52,32.08 16.52,30.49 v15.57,29.54 14.62,28.59 13.35,28.59 12.71,27.95 12.71,26.05 12.08,25.41 9.22,25.41 8.58,24.78 8.58,22.87 v8.9,22.55
  Bottom 0.2: IC5.4 11.12,22.24 11.44,22.55 C24.1 | IC6.4 C18.1 | C20.1 9.32,58.65 9.16,58.81 IC4.4 | IC3.4 27.16,71.55 C22.1 | IC2.4 27.32,89.86 27.63,90.18 27.95,90.18 28.27,90.5 28.27,91.03 C26.1 | D7.1 13.63,73.33 IC1.9 | C28.1 11.44,72.5 11.44,74.31 | R16.2 13.66,92.64 12.81,91.79 12.81,88.26 12.96,88.11 13.32,88.11 14.17,87.26 14.17,86.23 14.8,85.6 15.89,85.6 16.52,84.96 v16.52,84.47
  Bottom 0.508: v10.49,74.31 11.44,74.31 IC1.9 13.98,74.31 15.25,75.58 15.25,83.2 v16.52,84.47 | v27.32,87.01 IC2.4 | v27,68.91 IC3.4 | v7.63,59.38 IC4.4 | IC6.4 v15.57,29.54 | v8.9,22.55 9.22,22.24 IC5.4

### Text on the board
tPlace: kocmoc svf / v 1.7 smd one brd | power of the / hydro cubes
bPlace: github.com/janne808/Kocmoc-Eurorack